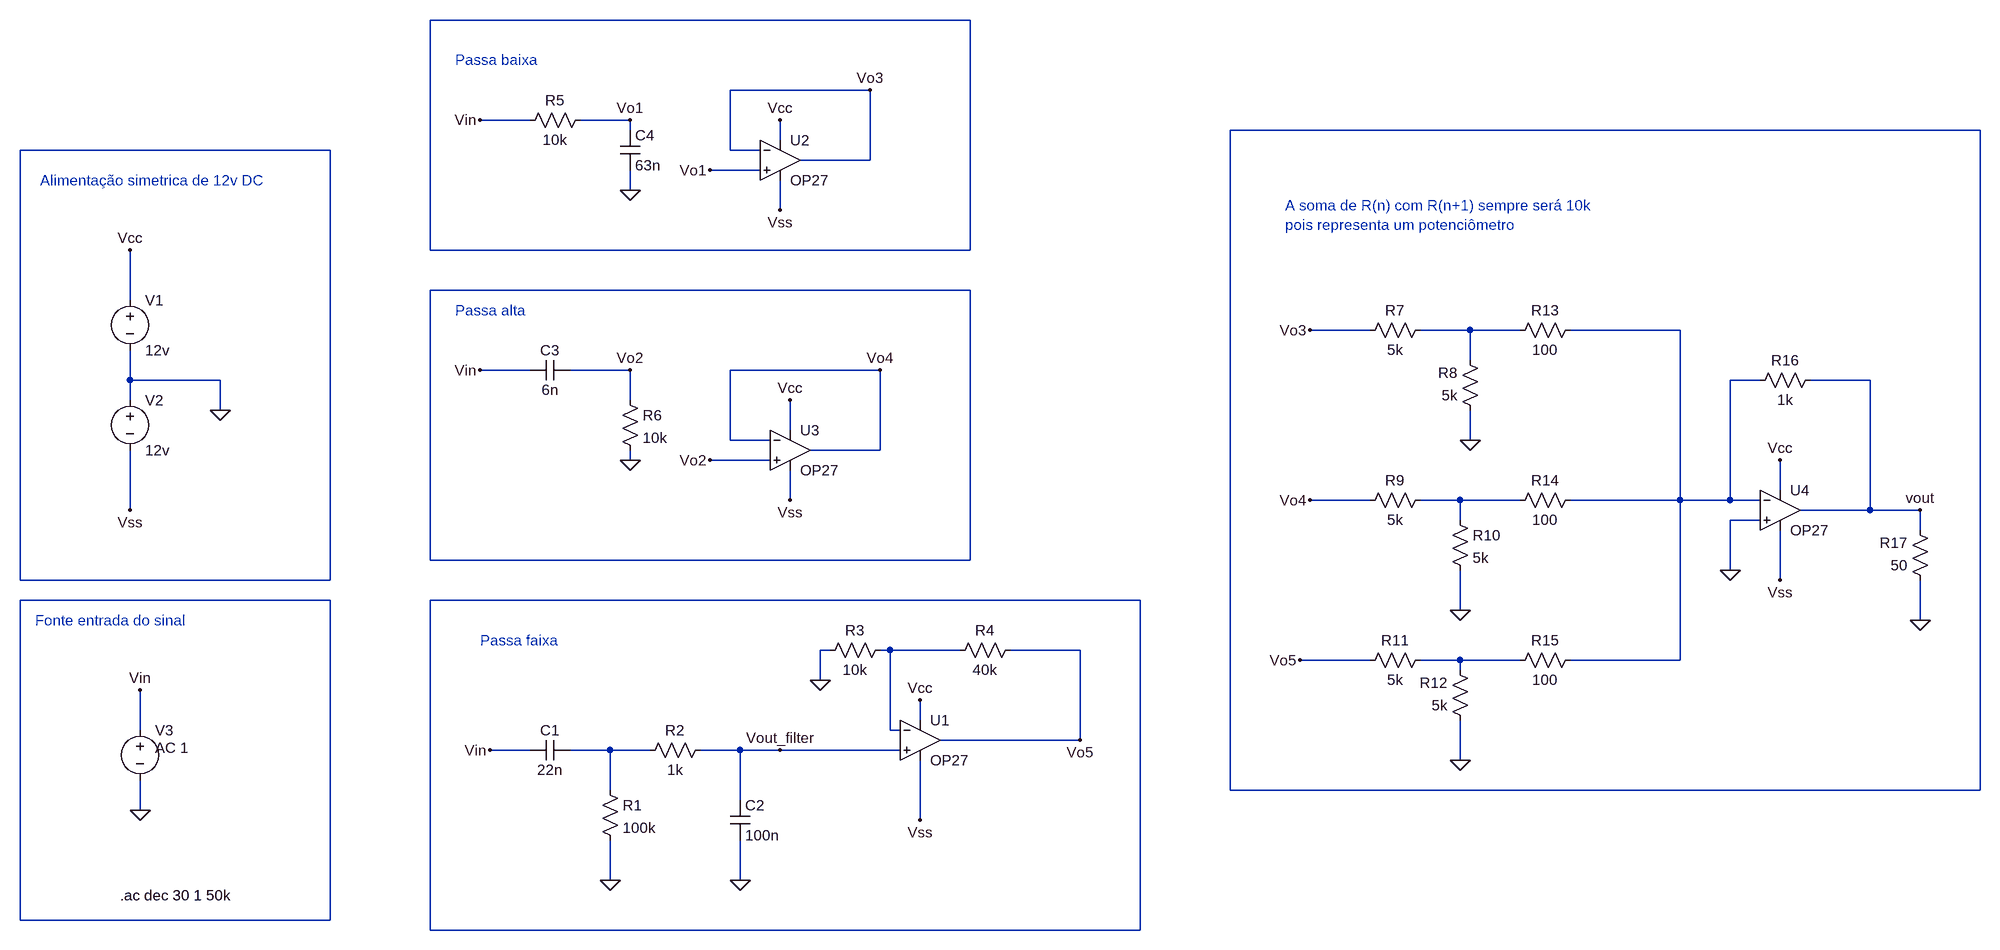
[diagram p0: schematic final.asc]
final.asc, the LTspice schematic file:
Version 4
SHEET 1 3668 680
WIRE 1408 -992 544 -992
WIRE 1248 -880 1024 -880
WIRE 704 -832 624 -832
WIRE 864 -832 784 -832
WIRE 864 -816 864 -832
WIRE 3024 -816 1824 -816
WIRE 1104 -800 1104 -832
WIRE 384 -784 -112 -784
WIRE 1024 -784 1024 -880
WIRE 1072 -784 1024 -784
WIRE 1248 -768 1248 -880
WIRE 1248 -768 1136 -768
WIRE 1072 -752 992 -752
WIRE 864 -720 864 -752
WIRE 1104 -688 1104 -736
WIRE 544 -624 544 -992
WIRE 1408 -624 1408 -992
WIRE 1408 -624 544 -624
WIRE 1408 -560 544 -560
WIRE 64 -544 64 -624
WIRE 2048 -496 1952 -496
WIRE 2208 -496 2128 -496
WIRE 2288 -496 2208 -496
WIRE 2544 -496 2368 -496
WIRE 2208 -448 2208 -496
WIRE 704 -432 624 -432
WIRE 864 -432 768 -432
WIRE 1264 -432 1024 -432
WIRE 64 -416 64 -464
WIRE 208 -416 64 -416
WIRE 2672 -416 2624 -416
WIRE 2848 -416 2752 -416
WIRE 64 -384 64 -416
WIRE 864 -384 864 -432
WIRE 208 -368 208 -416
WIRE 1120 -336 1120 -384
WIRE 1024 -320 1024 -432
WIRE 1088 -320 1024 -320
WIRE 2208 -320 2208 -368
WIRE 1264 -304 1264 -432
WIRE 1264 -304 1152 -304
WIRE 864 -288 864 -304
WIRE 1088 -288 992 -288
WIRE 2704 -240 2704 -288
WIRE 1120 -224 1120 -272
WIRE 2048 -224 1952 -224
WIRE 2192 -224 2128 -224
WIRE 2288 -224 2192 -224
WIRE 2544 -224 2544 -496
WIRE 2544 -224 2368 -224
WIRE 2624 -224 2624 -416
WIRE 2624 -224 2544 -224
WIRE 2672 -224 2624 -224
WIRE 64 -208 64 -304
WIRE 2848 -208 2848 -416
WIRE 2848 -208 2736 -208
WIRE 2928 -208 2848 -208
WIRE 2192 -192 2192 -224
WIRE 2672 -192 2624 -192
WIRE 2928 -176 2928 -208
WIRE 544 -128 544 -560
WIRE 1408 -128 1408 -560
WIRE 1408 -128 544 -128
WIRE 2624 -112 2624 -192
WIRE -112 -96 -112 -784
WIRE 384 -96 384 -784
WIRE 384 -96 -112 -96
WIRE 2704 -96 2704 -176
WIRE 384 -64 -112 -64
WIRE 1680 -64 544 -64
WIRE 2192 -48 2192 -112
WIRE 2928 -32 2928 -96
WIRE 1184 16 1168 16
WIRE 1280 16 1264 16
WIRE 1392 16 1280 16
WIRE 1584 16 1472 16
WIRE 2048 32 1936 32
WIRE 2192 32 2128 32
WIRE 2288 32 2192 32
WIRE 2544 32 2544 -224
WIRE 2544 32 2368 32
WIRE 2192 48 2192 32
WIRE 1168 64 1168 16
WIRE 1328 128 1328 96
WIRE 80 144 80 80
WIRE 1280 144 1280 16
WIRE 1296 144 1280 144
WIRE 1584 160 1584 16
WIRE 1584 160 1360 160
WIRE 704 176 640 176
WIRE 832 176 768 176
WIRE 896 176 832 176
WIRE 1040 176 976 176
WIRE 1104 176 1040 176
WIRE 1296 176 1104 176
WIRE 2192 192 2192 128
WIRE 832 240 832 176
WIRE 1824 240 1824 -816
WIRE 3024 240 3024 -816
WIRE 3024 240 1824 240
WIRE 1040 256 1040 176
WIRE 80 272 80 224
WIRE 1328 288 1328 192
WIRE 832 384 832 320
WIRE 1040 384 1040 320
WIRE -112 448 -112 -64
WIRE 384 448 384 -64
WIRE 384 448 -112 448
WIRE 544 464 544 -64
WIRE 1680 464 1680 -64
WIRE 1680 464 544 464
FLAG 64 -208 Vss
FLAG 64 -624 Vcc
FLAG 208 -368 0
FLAG 80 272 0
FLAG 80 80 Vin
FLAG 832 384 0
FLAG 1040 384 0
FLAG 640 176 Vin
FLAG 1104 176 Vout_filter
FLAG 1328 288 Vss
FLAG 1328 96 Vcc
FLAG 1168 64 0
FLAG 1584 160 Vo5
FLAG 624 -832 Vin
FLAG 624 -432 Vin
FLAG 864 -832 Vo1
FLAG 864 -288 0
FLAG 864 -720 0
FLAG 864 -432 Vo2
FLAG 1104 -832 Vcc
FLAG 1104 -688 Vss
FLAG 1120 -384 Vcc
FLAG 1120 -224 Vss
FLAG 992 -752 Vo1
FLAG 992 -288 Vo2
FLAG 1248 -880 Vo3
FLAG 1264 -432 Vo4
FLAG 1952 -496 Vo3
FLAG 1952 -224 Vo4
FLAG 1936 32 Vo5
FLAG 2208 -320 0
FLAG 2192 -48 0
FLAG 2192 192 0
FLAG 2704 -288 Vcc
FLAG 2704 -96 Vss
FLAG 2624 -112 0
FLAG 2928 -32 0
FLAG 2928 -208 vout
SYMBOL voltage 64 -560 R0
WINDOW 123 0 0 Left 0
WINDOW 39 0 0 Left 0
SYMATTR InstName V1
SYMATTR Value 12v
SYMBOL voltage 64 -400 R0
WINDOW 123 0 0 Left 0
WINDOW 39 0 0 Left 0
SYMATTR InstName V2
SYMATTR Value 12v
SYMBOL voltage 80 128 R0
WINDOW 123 24 44 Left 2
WINDOW 39 0 0 Left 0
SYMATTR Value2 AC 1
SYMATTR InstName V3
SYMATTR Value ""
SYMBOL cap 768 160 R90
WINDOW 0 0 32 VBottom 2
WINDOW 3 32 32 VTop 2
SYMATTR InstName C1
SYMATTR Value 22n
SYMBOL res 816 224 R0
SYMATTR InstName R1
SYMATTR Value 100k
SYMBOL res 992 160 R90
WINDOW 0 0 56 VBottom 2
WINDOW 3 32 56 VTop 2
SYMATTR InstName R2
SYMATTR Value 1k
SYMBOL cap 1024 256 R0
SYMATTR InstName C2
SYMATTR Value 100n
SYMBOL Opamps\\OP27 1328 96 R0
SYMATTR InstName U1
SYMBOL res 1280 0 R90
WINDOW 0 0 56 VBottom 2
WINDOW 3 32 56 VTop 2
SYMATTR InstName R3
SYMATTR Value 10k
SYMBOL res 1488 0 R90
WINDOW 0 0 56 VBottom 2
WINDOW 3 32 56 VTop 2
SYMATTR InstName R4
SYMATTR Value 40k
SYMBOL res 800 -848 R90
WINDOW 0 0 56 VBottom 2
WINDOW 3 32 56 VTop 2
SYMATTR InstName R5
SYMATTR Value 10k
SYMBOL cap 768 -448 R90
WINDOW 0 0 32 VBottom 2
WINDOW 3 32 32 VTop 2
SYMATTR InstName C3
SYMATTR Value 6n
SYMBOL cap 848 -816 R0
SYMATTR InstName C4
SYMATTR Value 63n
SYMBOL res 848 -400 R0
SYMATTR InstName R6
SYMATTR Value 10k
SYMBOL Opamps\\OP27 1104 -832 R0
SYMATTR InstName U2
SYMBOL Opamps\\OP27 1120 -368 R0
SYMATTR InstName U3
SYMBOL res 2144 -512 R90
WINDOW 0 0 56 VBottom 2
WINDOW 3 32 56 VTop 2
SYMATTR InstName R7
SYMATTR Value 5k
SYMBOL res 2224 -352 R180
WINDOW 0 36 76 Left 2
WINDOW 3 36 40 Left 2
SYMATTR InstName R8
SYMATTR Value 5k
SYMBOL res 2032 -208 R270
WINDOW 0 32 56 VTop 2
WINDOW 3 0 56 VBottom 2
SYMATTR InstName R9
SYMATTR Value 5k
SYMBOL res 2176 -208 R0
SYMATTR InstName R10
SYMATTR Value 5k
SYMBOL res 2144 16 R90
WINDOW 0 0 56 VBottom 2
WINDOW 3 32 56 VTop 2
SYMATTR InstName R11
SYMATTR Value 5k
SYMBOL res 2208 144 R180
WINDOW 0 36 76 Left 2
WINDOW 3 36 40 Left 2
SYMATTR InstName R12
SYMATTR Value 5k
SYMBOL res 2384 -512 R90
WINDOW 0 0 56 VBottom 2
WINDOW 3 32 56 VTop 2
SYMATTR InstName R13
SYMATTR Value 100
SYMBOL res 2384 -240 R90
WINDOW 0 0 56 VBottom 2
WINDOW 3 32 56 VTop 2
SYMATTR InstName R14
SYMATTR Value 100
SYMBOL res 2384 16 R90
WINDOW 0 0 56 VBottom 2
WINDOW 3 32 56 VTop 2
SYMATTR InstName R15
SYMATTR Value 100
SYMBOL Opamps\\OP27 2704 -272 R0
SYMATTR InstName U4
SYMBOL res 2768 -432 R90
WINDOW 0 0 56 VBottom 2
WINDOW 3 32 56 VTop 2
SYMATTR InstName R16
SYMATTR Value 1k
SYMBOL res 2944 -80 R180
WINDOW 0 36 76 Left 2
WINDOW 3 36 40 Left 2
SYMATTR InstName R17
SYMATTR Value 50
TEXT 48 408 Left 2 !.ac dec 30 1 50k
TEXT -80 -736 Left 2 ;Alimentação simetrica de 12v DC
TEXT -88 -32 Left 2 ;Fonte entrada do sinal
TEXT 624 0 Left 2 ;Passa faixa
TEXT 584 -928 Left 2 ;Passa baixa
TEXT 584 -528 Left 2 ;Passa alta
TEXT 1912 -696 Left 2 ;A soma de R(n) com R(n+1) sempre será 10k \npois representa um potenciômetro

The netlist it stands for:
* final.asc
V1 Vcc 0 12v
V2 0 Vss 12v
V3 Vin 0 AC 1
C1 N012 Vin 22n
R1 N012 0 100k
R2 Vout_filter N012 1k
C2 Vout_filter 0 100n
XU1 Vout_filter N010 Vcc Vss Vo5 OP27  ; pins In+ In- V+ V- OUT
R3 N010 0 10k
R4 Vo5 N010 40k
R5 Vo1 Vin 10k
C3 Vo2 Vin 6n
C4 Vo1 0 63n
R6 Vo2 0 10k
XU2 Vo1 Vo3 Vcc Vss Vo3 OP27  ; pins In+ In- V+ V- OUT
XU3 Vo2 Vo4 Vcc Vss Vo4 OP27  ; pins In+ In- V+ V- OUT
R7 N005 Vo3 5k
R8 0 N005 5k
R9 Vo4 N007 5k
R10 N007 0 5k
R11 N011 Vo5 5k
R12 0 N011 5k
R13 N006 N005 100
R14 N006 N007 100
R15 N006 N011 100
XU4 0 N006 Vcc Vss vout OP27  ; pins In+ In- V+ V- OUT
R16 vout N006 1k
R17 0 vout 50
.ac dec 30 1 50k
* Alimentação simetrica de 12v DC
* Fonte entrada do sinal
* Passa faixa
* Passa baixa
* Passa alta
* A soma de R(n) com R(n+1) sempre será 10k
* pois representa um potenciômetro
.lib ADI.lib
.backanno
.end